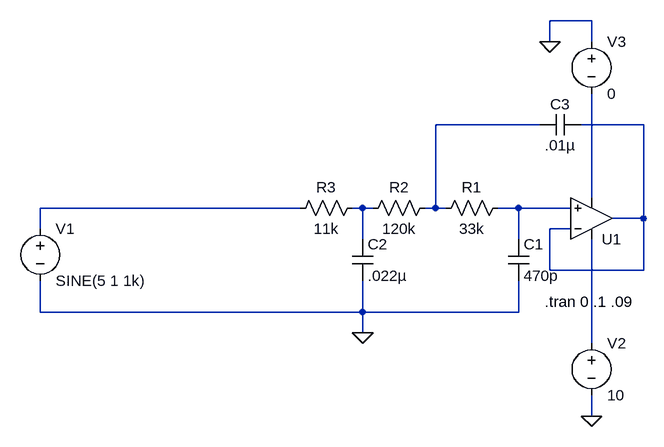
[diagram p0: schematic ThirdLow.asc]
ThirdLow.asc, the LTspice schematic file:
Version 4
SHEET 1 880 680
WIRE 464 32 400 32
WIRE 400 64 400 32
WIRE 464 64 464 32
WIRE 384 192 224 192
WIRE 544 192 448 192
WIRE 464 304 464 144
WIRE 16 320 -384 320
WIRE 112 320 96 320
WIRE 128 320 112 320
WIRE 224 320 224 192
WIRE 224 320 208 320
WIRE 240 320 224 320
WIRE 352 320 320 320
WIRE 432 320 352 320
WIRE 544 336 544 192
WIRE 544 336 496 336
WIRE -384 352 -384 320
WIRE 432 352 400 352
WIRE 112 368 112 320
WIRE 352 368 352 320
WIRE 400 416 400 352
WIRE 544 416 544 336
WIRE 544 416 400 416
WIRE -384 480 -384 432
WIRE 112 480 112 432
WIRE 112 480 -384 480
WIRE 352 480 352 432
WIRE 352 480 112 480
WIRE 112 512 112 480
WIRE 464 528 464 368
WIRE 464 640 464 608
FLAG 112 512 0
FLAG 464 640 0
FLAG 400 64 0
SYMBOL res 336 304 R90
WINDOW 0 0 56 VBottom 2
WINDOW 3 32 56 VTop 2
SYMATTR InstName R1
SYMATTR Value 33k
SYMBOL res 224 304 R90
WINDOW 0 0 56 VBottom 2
WINDOW 3 32 56 VTop 2
SYMATTR InstName R2
SYMATTR Value 120k
SYMBOL res 112 304 R90
WINDOW 0 0 56 VBottom 2
WINDOW 3 32 56 VTop 2
SYMATTR InstName R3
SYMATTR Value 11k
SYMBOL cap 336 368 R0
SYMATTR InstName C1
SYMATTR Value 470p
SYMBOL cap 96 368 R0
SYMATTR InstName C2
SYMATTR Value .022µ
SYMBOL cap 448 176 R90
WINDOW 0 0 32 VBottom 2
WINDOW 3 32 32 VTop 2
SYMATTR InstName C3
SYMATTR Value .01µ
SYMBOL voltage -384 336 R0
WINDOW 39 0 0 Left 2
SYMATTR InstName V1
SYMATTR Value SINE(5 1 1k)
SYMATTR Value2 AC 1
SYMBOL Opamps/UniversalOpamp2 464 336 M180
SYMATTR InstName U1
SYMBOL voltage 464 512 R0
SYMATTR InstName V2
SYMATTR Value 10
SYMBOL voltage 464 48 R0
SYMATTR InstName V3
SYMATTR Value 0
TEXT 392 464 Left 2 !.tran 0 .1 .09

The netlist it stands for:
* ThirdLow.asc
R1 N006 N001 33k
R2 N001 N005 120k
R3 N005 N004 11k
C1 N006 0 470p
C2 N005 0 .022µ
C3 N002 N001 .01µ
V1 N004 0 SINE(5 1 1k) AC 1
XU1 N006 N002 N007 N003 N002 level.2 Avol=1Meg GBW=10Meg Slew=10Meg ilimit=25m rail=0 Vos=0 phimargin=45 en=0 enk=0 in=0 ink=0 Rin=500Meg  ; pins IN+ IN- V+ V- OUT
V2 N007 0 10
V3 0 N003 0
.tran 0 .1 .09
.lib UniversalOpamps2.sub
.backanno
.end